# Altium schematic sheet SH1-MCU.SchDoc: SH1_MCU
size Letter; DrawnBy: Qinyang Bao; SheetNumber: 1; SheetTotal: 4
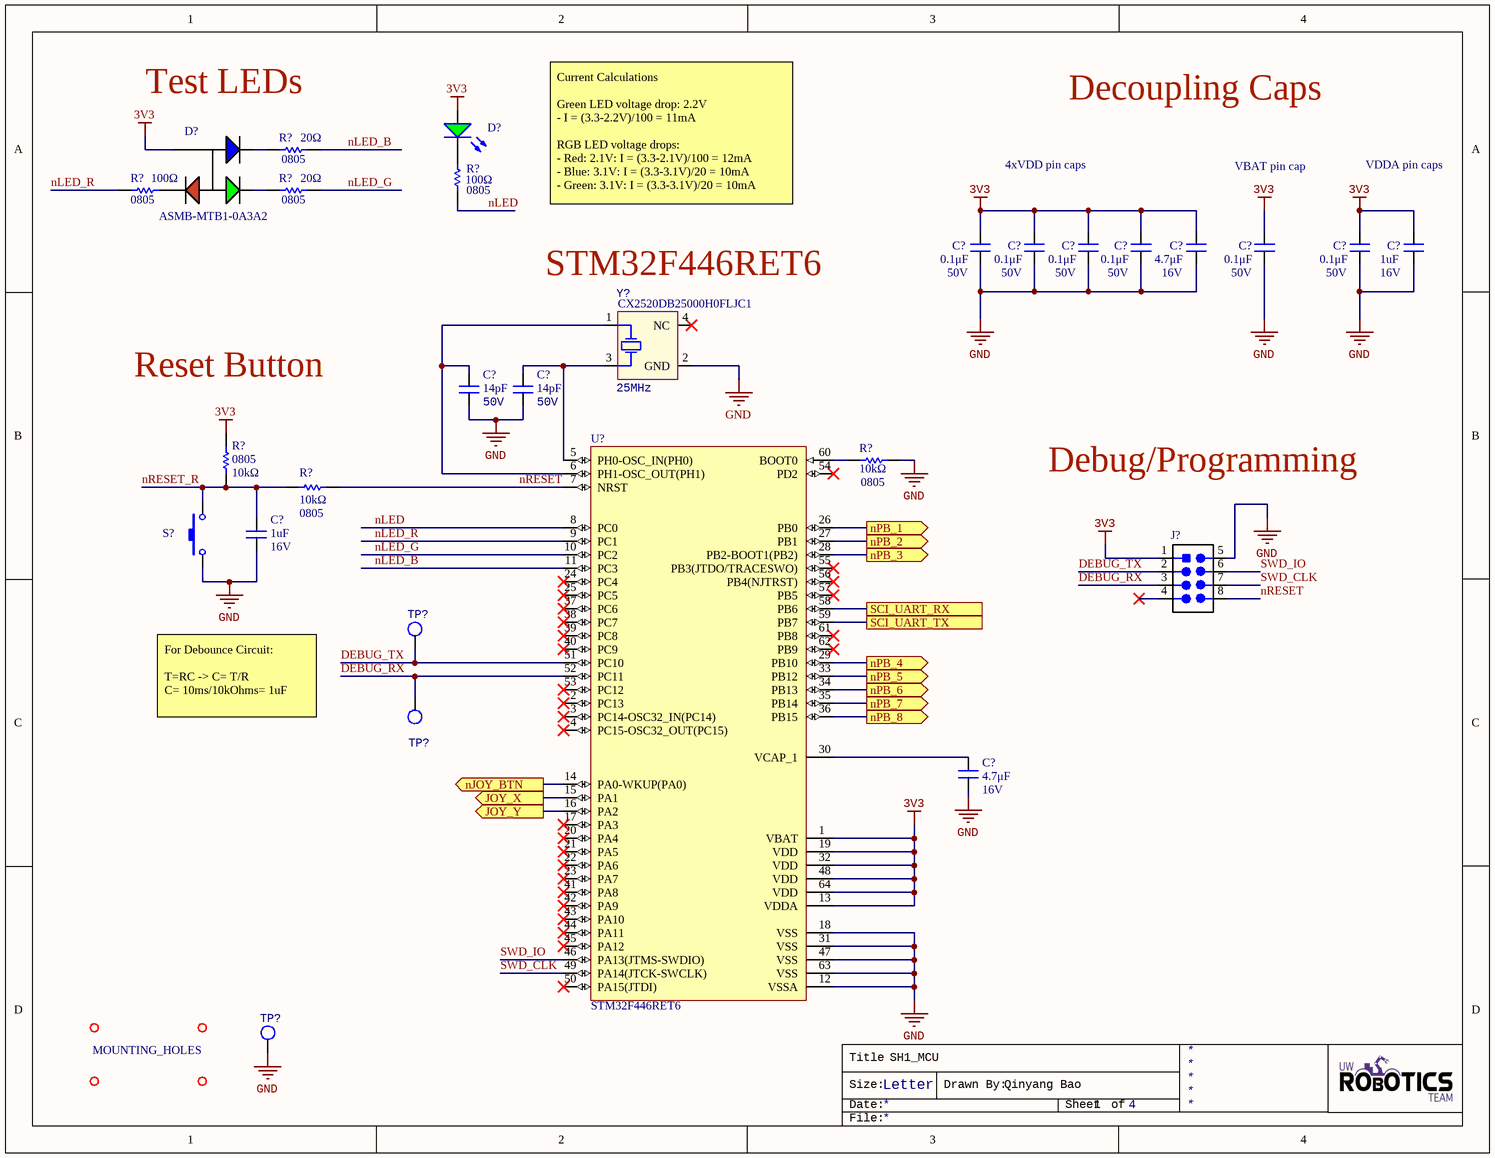
[diagram p0: SH1-MCU.SchDoc]

## Parts
(Parts that share a designator on the sheet are numbered #1, #2 ... from top to bottom, then left to right.)
C?#1  Voltage Rating: 50V  [CAPC2012X140N]  (hidden comment: 0.1μF)
C?#2  Voltage Rating: 50V  [CAPC2012X140N]  (hidden comment: 0.1μF)
C?#3  Voltage Rating: 50V  [CAPC2012X140N]  (hidden comment: 0.1μF)
C?#4  Voltage Rating: 50V  [CAPC2012X140N]  (hidden comment: 0.1μF)
C?#5  value 4.7μF  Voltage Rating: 16V  [CAPC2012X140N]  (hidden comment: CAP_4.7uF_16V_0805)
C?#6  Voltage Rating: 50V  [CAPC2012X140N]  (hidden comment: 0.1μF)
C?#7  Voltage Rating: 50V  [CAPC2012X140N]  (hidden comment: 0.1μF)
C?#8  value 1uF  Voltage Rating: 16V  [CAPC2012X140N]  (hidden comment: CAP_1uF_16V_0805)
C?#9  value 14pF  Voltage Rating (DC): 50V  [CAPC0603(1608)55_N]  (hidden comment: CL10C140JB8NNNC)
C?#10  value 14pF  Voltage Rating (DC): 50V  [CAPC0603(1608)55_N]  (hidden comment: CL10C140JB8NNNC)
C?#11  value 1uF  Voltage Rating: 16V  [CAPC2012X140N]  (hidden comment: CAP_1uF_16V_0805)
C?#12  value 4.7μF  Voltage Rating: 16V  [CAPC2012X140N]  (hidden comment: CAP_4.7uF_16V_0805)
D?#1  LG R971-KN-1  [LED_0805_LINE]  (value not drawn)
D?#2  Manufacturer Part Number 1: ASMB-MTB1-0A3A2  [LED_RGB]  (hidden comment: LED_RGB)
J?  HEADER 4X2  [HEADER_2X4]  (value not drawn)
MH?#1  MOUNTING_HOLES  [MOUNTING_HOLE]  (value not drawn)
MH?#2  MOUNTING_HOLES  [MOUNTING_HOLE]  (value not drawn)
MH?#3  MOUNTING_HOLES  [MOUNTING_HOLE]
MH?#4  MOUNTING_HOLES  [MOUNTING_HOLE]  (value not drawn)
R?#1  value 20Ω  Case Code (Imperial): 0805  [RESC2012X60N]  (hidden comment: RES_20Ω_0805)
R?#2  value 100Ω  Case Code (Imperial): 0805  [RESC2012X60N]  (hidden comment: RES_100Ω_0805)
R?#3  value 100Ω  Case Code (Imperial): 0805  [RESC2012X60N]  (hidden comment: RES_100Ω_0805)
R?#4  value 20Ω  Case Code (Imperial): 0805  [RESC2012X60N]  (hidden comment: RES_20Ω_0805)
R?#5  value 10kΩ  Case Code (Imperial): 0805  [RESC2012X60N]  (hidden comment: RES_10kΩ_0805)
R?#6  value 10kΩ  Case Code (Imperial): 0805  [RESC2012X60N]  (hidden comment: RES_10kΩ_0805)
R?#7  value 10kΩ  Case Code (Imperial): 0805  [RESC2012X60N]  (hidden comment: RES_10kΩ_0805)
S?  SW_TACTILE  [B3U-1000P]  (value not drawn)
TP?#1  TESTPOINT_LOOP  [TESTPOINT_LOOP]  (value not drawn)
TP?#2  TESTPOINT_LOOP  [TESTPOINT_LOOP]  (value not drawn)
TP?#3  TESTPOINT_LOOP  [TESTPOINT_LOOP]  (value not drawn)
U?  STM32F446RET6  [STM-LQFP64_L]
Y?  Manufacturer Part Number 1: CX2520DB25000H0FLJC1  Frequency: 25MHz  [SOIC254P1016X440-4N]  (hidden comment: CRYSTAL_25MHZ)

## Ports
JOY_X (out), JOY_Y (out), nJOY_BTN (out), nPB_1 (out), nPB_2 (out), nPB_3 (out), nPB_4 (out), nPB_5 (out), nPB_6 (out), nPB_7 (out), nPB_8 (out), SCI_UART_RX, SCI_UART_TX

## Nets
3V3: C?#1.2 C?#2.2 C?#3.2 C?#4.2 C?#5.2 C?#6.2 C?#7.2 C?#8.2 D?#1.1(A) D?#2.4 J?.1(VCC) R?#5.2 U?.1(VBAT) U?.13(VDDA) U?.19(VDD) U?.32(VDD) U?.48(VDD) U?.64(VDD)
GND: C?#1.1 C?#2.1 C?#3.1 C?#4.1 C?#5.1 C?#6.1 C?#7.1 C?#8.1 C?#9.1 C?#10.1 C?#11.1 C?#12.1 J?.5(GND) R?#6.2 S?.2 TP?#3.1 U?.12(VSSA) U?.18(VSS) U?.31(VSS) U?.47(VSS) U?.63(VSS) Y?.2(GND)
DEBUG_RX: J?.3 TP?#2.1 U?.52(PC11)
DEBUG_TX: J?.2 TP?#1.1 U?.51(PC10)
JOY_X: U?.15(PA1) ; port JOY_X
JOY_Y: U?.16(PA2) ; port JOY_Y
nJOY_BTN: U?.14(PA0-WKUP(PA0)) ; port nJOY_BTN
nLED: R?#2.1 U?.8(PC0)
nLED_B: R?#1.2 U?.11(PC3)
nLED_G: R?#4.2 U?.10(PC2)
nLED_R: R?#3.1 U?.9(PC1)
nPB_1: U?.26(PB0) ; port nPB_1
nPB_2: U?.27(PB1) ; port nPB_2
nPB_3: U?.28(PB2-BOOT1(PB2)) ; port nPB_3
nPB_4: U?.29(PB10) ; port nPB_4
nPB_5: U?.33(PB12) ; port nPB_5
nPB_6: U?.34(PB13) ; port nPB_6
nPB_7: U?.35(PB14) ; port nPB_7
nPB_8: U?.36(PB15) ; port nPB_8
nRESET: J?.8 R?#7.2 U?.7(NRST)
nRESET_R: C?#11.2 R?#5.1 R?#7.1 S?.1
SCI_UART_RX: U?.58(PB6) ; port SCI_UART_RX
SCI_UART_TX: U?.59(PB7) ; port SCI_UART_TX
SWD_CLK: J?.7 U?.49(PA14(JTCK-SWCLK))
SWD_IO: J?.6 U?.46(PA13(JTMS-SWDIO))
NetC?#9_2: C?#9.2 U?.6(PH1-OSC_OUT(PH1)) Y?.1(HOT)
NetC?#10_2: C?#10.2 U?.5(PH0-OSC_IN(PH0)) Y?.3(HOT)
NetC?#12_2: C?#12.2 U?.30(VCAP_1)
NetD?#1_2: D?#1.2(K) R?#2.2
NetD?#2_1: D?#2.1 R?#3.2
NetD?#2_2: D?#2.2 R?#4.1
NetD?#2_3: D?#2.3 R?#1.1
NetR?#6_1: R?#6.1 U?.60(BOOT0)

Not connected (* = marked no-connect by the designer): J? 4*; U? 2(PC13)* 3(PC14-OSC32_IN(PC14))* 4(PC15-OSC32_OUT(PC15))* 17(PA3)* 20(PA4)* 21(PA5)* 22(PA6)* 23(PA7)* 24(PC4)* 25(PC5)* 37(PC6)* 38(PC7)* 39(PC8)* 40(PC9)* 41(PA8)* 42(PA9)* 43(PA10)* 44(PA11)* 45(PA12)* 50(PA15(JTDI))* 53(PC12)* 54(PD2)* 55(PB3(JTDO/TRACESWO))* 56(PB4(NJTRST))* 57(PB5)* 61(PB8)* 62(PB9)*; Y? 4(NC)*

## Notes on the sheet
- Test LEDs
- 4xVDD pin caps
- Decoupling Caps
- VDDA pin caps
- Current Calculations
  Green LED voltage drop: 2.2V
  - I = (3.3-2.2V)/100 = 11mA
  RGB LED voltage drops:
  - Red: 2.1V: I = (3.3-2.1V)/100 = 12mA
  - Blue: 3.1V: I = (3.3-3.1V)/20 = 10mA
  - Green: 3.1V: I = (3.3-3.1V)/20 = 10mA
- VBAT pin cap
- (near Y?) STM32F446RET6
- Reset Button
- Debug/Programming
- For Debounce Circuit:
  T=RC -> C= T/R
  C= 10ms/10kOhms= 1uF
- Title
- Size:
- Date:
- Letter
- Drawn By:
- Sheet
- of
- File:

## Library data of the parts
C?#1-C?#4 C?#6 C?#7 = CAP_0.1uF_50V_0805: CAP CER 0.1UF 50V X7R 0805; Manufacturer 1: Murata Electronics; Manufacturer Part Number 1: GCD21BR71H104KA01L; Tolerance: 10%; Mount: Surface Mount; Case Code (Metric): 2012; Case Code (Imperial): 0805; Min Operating Temperature: -55°C; Max Operating Temperature: 125°C; Dielectric: X7R; Termination: SMD/SMT; Length: 2mm; Height: 1.25mm; Width: 0.049inch; Thickness: 0.049inch; Depth: 1.25mm; Ratings: AEC-Q200; ComponentLink1URL: https://datasheet.ciiva.com/29537/c03e-29537701.pdf?src-supplier=Digi-Key; ComponentLink1Description: https://datasheet.ciiva.com/29537/c03e-29537701.pdf?src-supplier=Digi-Key; Supplier 1: Digi-Key; Supplier Part Number 1: 490-11955-1-ND; Value: 0.1μF; Package: 0805 (2012 Metric)
C?#5 C?#12 = CAP_4.7uF_16V_0805: CAP CER 4.7UF 16V X5R 0805; Manufacturer 1: Samsung Electro-Mechanics; Manufacturer Part Number 1: CL21A475KOFNNNE; Tolerance: 10%; Mount: Surface Mount; Case Code (Metric): 2012; Case Code (Imperial): 0805; Min Operating Temperature: -55°C; Max Operating Temperature: 85°C; Dielectric: X5R; Termination: SMD/SMT; Supplier 1: Digi-Key; Supplier Part Number 1: 1276-1065-1-ND; Package: 0805 (2012 Metric)
C?#8 C?#11 = CAP_1uF_16V_0805: CAP CER 1UF 16V X7R 0805; Manufacturer 1: Yageo; Manufacturer Part Number 1: CC0805KKX7R7BB105; Tolerance: 10%; Mount: Surface Mount; Case Code (Metric): 2012; Case Code (Imperial): 0805; Min Operating Temperature: -55°C; Max Operating Temperature: 125°C; Dielectric: X7R; Termination: SMD/SMT; Supplier 1: Digi-Key; Supplier Part Number 1: 311-1365-1-ND; Package: 0805 (2012 Metric)
C?#9 C?#10 = CL10C140JB8NNNC: Cap Ceramic 14pF 50V C0G 5% SMD 0603 125C Cardboard T/R; Manufacturer 1: Samsung; Voltage Rating: 50V; Supplier Part Number 1: 1276-2187-1-ND; Supplier 1: Digi-Key; Manufacturer Part Number 1: CL10C140JB8NNNC; Stock 1: 187088; Pricing 1: 1=0.10000, 10=0.06700, 100=0.02980, 500=0.02130, 1000=0.01673 (USD); RoHS: Yes; Mount: Surface Mount; Case/Package: 0603; Case Code (Metric): 1608; Case Code (Imperial): 0603; Min Operating Temperature: -55°C; Max Operating Temperature: 125°C; Tolerance: 5%; Package Quantity: 1; Packaging: Tape and Reel; Dielectric: C0G; Length: 1.6mm; Height: 0.8mm; Width: 0.031inch; Depth: 0.8mm; Thickness: 0.035inch; Radiation Hardening: No; ComponentLink1URL: https://datasheet.ciiva.com/25782/cl10c140jb8nnnc-25782947.pdf?src-supplier=Digi-Key; ComponentLink1Description: https://datasheet.ciiva.com/25782/cl10c140jb8nnnc-25782947.pdf?src-supplier=Digi-Key; Capacitance: 14pF
D?#1 = DIO_LED_G: LED GREEN DIFFUSED 0805 SMD; Manufacturer 1: OSRAM; Forward Voltage Drop: 2.2V; Package: 0805 (2012 Metric); Supplier Part Number 1: 475-1410-1-ND; Supplier 1: Digi-Key; Manufacturer Part Number 1: LG R971-KN-1; Mount: Surface Mount
D?#2 = LED_RGB: LED RGB DIFFUSED 4PLCC SMD; Manufacturer 1: Broadcom; Color: Blue,Green,Red; Lens Color: White; Viewing Angle: 115°; Lens Style: Round; Luminous Intensity: 350mcd; Dominant Wavelength: 470nm; Forward Voltage: 3.1V; Test Current: 20mA; Supplier 1: Digi-Key; Stock 1: 142531; Pricing 1: 1=0.60000, 10=0.47100, 100=0.30210, 500=0.25980, 1000=0.20059 (USD); RoHS: Yes; Mount: Surface Mount; Case/Package: PLCC; Number of Pins: 4; Packaging: Cut Tape; Lens Transparency: Diffused; Length: 3.2mm; Height: 1.9mm; Width: 2.8mm; REACH SVHC: No SVHC; ComponentLink1URL: http://www.farnell.com/datasheets/2111106.pdf?src-supplier=Farnell; ComponentLink1Description: http://www.farnell.com/datasheets/2111106.pdf?src-supplier=Farnell; ComponentLink2URL: https://docs.broadcom.com/docs/AV02-4194EN?src-supplier=Digi-Key; ComponentLink2Description: https://docs.broadcom.com/docs/AV02-4194EN?src-supplier=Digi-Key; ComponentLink3URL: http://www.farnell.com/datasheets/1801564.pdf?src-supplier=Element14; ComponentLink3Description: http://www.farnell.com/datasheets/1801564.pdf?src-supplier=Element14; ComponentLink4URL: http://www.farnell.com/datasheets/2111106.pdf?src-supplier=Newark; ComponentLink4Description: http://www.farnell.com/datasheets/2111106.pdf?src-supplier=Newark; Supplier Part Number 1: 516-3280-1-ND
J? = HEADER 4X2: CONN HEADER VERT 8POS 2.54MM; Manufacturer Part Number 1: M20-9980445; Manufacturer 1: Harwin Inc.; Supplier Part Number 1: 952-2122-ND; Supplier 1: Digi-Key; Mount: Through Hole
MH?#1-MH?#4 = MOUNTING_HOLES: 6cm x 6cm
R?#1 R?#4 = RES_20Ω_0805: RES SMD 20 OHM 1% 1/8W 0805; Manufacturer 1: Yageo; Manufacturer Part Number 1: RC0805FR-0720RL; Resistance: 20; Power Rating: 125mW; Supplier 1: Digi-Key; Case Code (Metric): 2012; Min Operating Temperature: -55°C; Max Operating Temperature: 155°C; Tolerance: 1%; Termination: SMD/SMT; Supplier Part Number 1: 311-20.0CRCT-ND; Package: 0805 (2012 Metric)
R?#2 R?#3 = RES_100Ω_0805: RES SMD 100 OHM 1% 1/8W 0805; Manufacturer 1: Yageo; Manufacturer Part Number 1: RC0805FR-07100RL; Power Rating: 125mW; Supplier 1: Digi-Key; Mount: Surface Mount; Case Code (Metric): 2012; Supplier Part Number 1: 311-100CRCT-ND; Package: 0805 (2012 Metric)
R?#5-R?#7 = RES_10kΩ_0805: RES SMD 10K OHM 1% 1/8W 0805; Manufacturer 1: Yageo; Manufacturer Part Number 1: RC0805FR-0710KL; Power Rating: 125mW; Supplier 1: Digi-Key; Case Code (Metric): 2012; Min Operating Temperature: -55°C; Max Operating Temperature: 155°C; Resistance: 10K; Tolerance: 1%; Termination: SMD/SMT; Supplier Part Number 1: 311-10.0KCRCT-ND; Package: 0805 (2012 Metric)
S? = SW_TACTILE: Tactile Switch (Grey); Manufacturer 1: Omron Electronics Inc-EMC Div; Manufacturer Part Number 1: B3U-1000P; Supplier 1: Digi-Key; Supplier Part Number 1: SW1020CT-ND; Mount: Surface Mount
TP?#1-TP?#3 = TESTPOINT_LOOP: Loop testpoint through-hole pad; Manufacturer Part Number 1: 5002; Manufacturer 1: Keystone Electronics; Supplier Part Number 1: 36-5002-ND; Supplier 1: Digi-Key; Mount: Through Hole
U? = MCU_STM32F446RET6: ARM Cortex-M4 32-bit MCU+FPU, 512 KB Flash, 128 KB Internal RAM, 50 I/Os, 64-Pin LQFP, -40 to 85 degC, Tray; I/Os (High Current): 50; Supply Voltage(Vcc) min (V): 1.7; Operating Frequency(F) (Processor speed) (MHz): 180; D/A Converter: 2; Internal RAM Size (kB): 128; FLASH Size (Prog) (kB): 512; Core: ARM Cortex-M4; ComponentLink1Description: Manufacturer URL; Package Reference: 64-Pin Low-profile Quad Flat Package, Body 10 x 10 mm, Pitch 0.5 mm; ComponentLink2URL: http://www.st.com/st-web-ui/static/active/en/resource/technical/document/datasheet/DM00141306.pdf; Packing: Tray; DatasheetVersion: Rev. 6; ComponentLink1URL: http://www.st.com/; ComponentLink2Description: Datasheet; Package Description: LQFP64; Mounting Technology: Surface Mount; Supplier Part Number 1: 497-15376-ND; Supplier 1: Digi-Key
Y? = CRYSTAL_25MHZ: CRYSTAL 25.0000MHZ 12PF SMD; Manufacturer 1: Kyocera AVX; ESR (Equivalent Series Resistance): 80R; Frequency Stability: 15ppm; Frequency Tolerance: 10ppm; ComponentLink1Description: https://media.digikey.com/pdf/Data%20Sheets/AVX%20PDFs/CX2520DB_USY1M-H1-16429-00_Spec.pdf?src-supplier=Digi-Key; ComponentLink1URL: https://media.digikey.com/pdf/Data%20Sheets/AVX%20PDFs/CX2520DB_USY1M-H1-16429-00_Spec.pdf?src-supplier=Digi-Key; Supplier 1: Digi-Key; Supplier Part Number 1: 1253-1724-1-ND; Stock 1: 11741; Pricing 1: 1=0.72000, 10=0.63300, 50=0.59120, 100=0.52250, 500=0.49500, 1000=0.41250 (USD); RoHS: Yes; Mount: Surface Mount; Case/Package: SMD/SMT; Min Operating Temperature: -30°C; Max Operating Temperature: 85°C; Packaging: Tape and Reel; Load Capacitance: 12pF; Length: 0.098inch; Height: 0.022inch; Width: 0.079inch; Ratings: AEC-Q200